# Altium project DelayedTimeRelay.PrjPcb
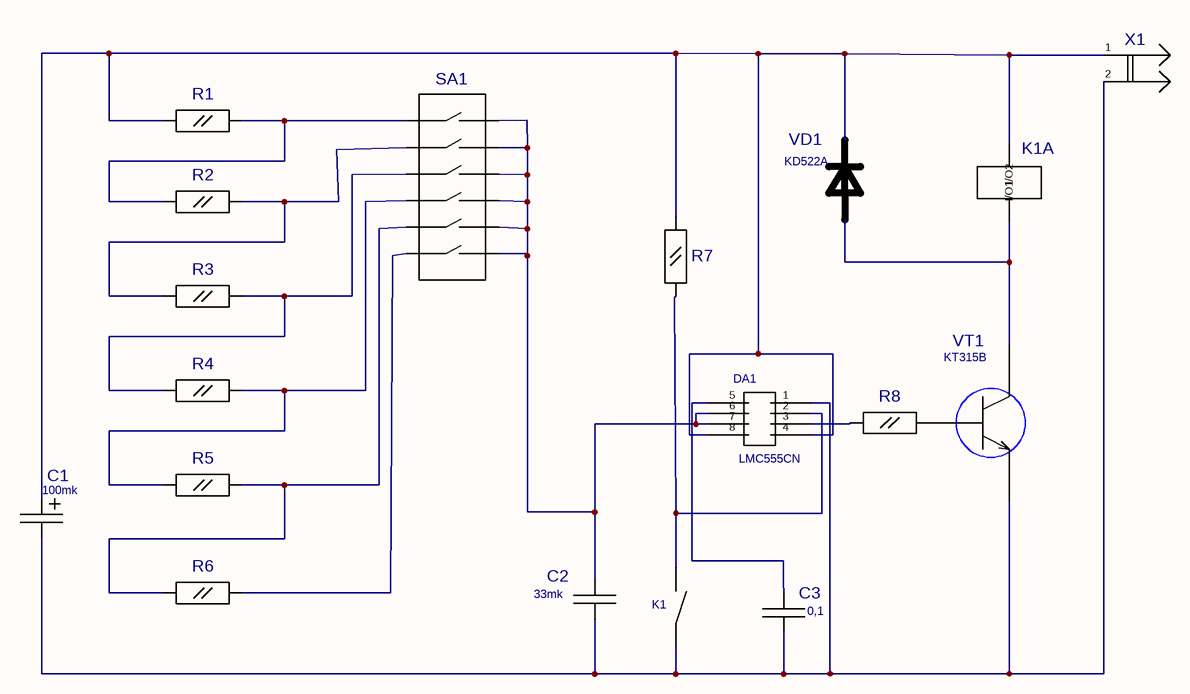
[diagram p0: Sheet1.SCHDOC]
1 sheet, 17 parts. Net scope: global (net labels, ports and power ports of the same name join across sheets).
Board file: DelayedTimeRelay.PcbDoc

## Sheet Sheet1.SCHDOC
size 297 x 209 mm; SheetNumber: 1; SheetTotal: 1; DocumentName: Sheet1.SCHDOC

### Parts
C1  value 100mk  [ECR-8]  (hidden comment: ECR-8)
C2  value 33mk  [1017-B3R]  (hidden comment: 1017-B3R)
C3  value 0,1  [1017-B3R]  (hidden comment: 1017-B3R)
DA1  LMC555CN  [LMC555CN]
K1  РЕЛЕ-6  [RELE6]  (value not drawn)  (parts A,B of 2)
R1  C2-33H-0.125W_OLD_UGO  [C2-33H-0.125W]  (value not drawn)
R2  C2-33H-0.125W_OLD_UGO  [C2-33H-0.125W]  (value not drawn)
R3  C2-33H-0.125W_OLD_UGO  [C2-33H-0.125W]  (value not drawn)
R4  C2-33H-0.125W_OLD_UGO  [C2-33H-0.125W]  (value not drawn)
R5  C2-33H-0.125W_OLD_UGO  [C2-33H-0.125W]  (value not drawn)
R6  C2-33H-0.125W_OLD_UGO  [C2-33H-0.125W]  (value not drawn)
R7  C2-33H-0.125W_OLD_UGO  [C2-33H-0.125W]  (value not drawn)
R8  C2-33H-0.125W_OLD_UGO  [C2-33H-0.125W]  (value not drawn)
SA1  DS1040-6  [DS1040-6]  (value not drawn)
VD1  value KD522A  [КД521(522)]  (hidden comment: КД522А)
VT1  value KT315B  [KT13]  (hidden comment: КТ315В)
X1  2XR  [2XR]  (value not drawn)

### Nets
NetC1_1: C1.1(I/OA) DA1.4 DA1.8 K1.2(I/O2) R1.1 R7.2 VD1.2(K) X1.1(I/O1)
NetC1_2: C1.2(I/OB) C2.2(I/OB) C3.2(I/OB) DA1.1 K1.3(I/O1) VT1.1(E) X1.2(I/O2)
NetC2_1: C2.1(I/OA) DA1.6 DA1.7 SA1.7 SA1.8 SA1.9 SA1.10 SA1.11 SA1.12
NetC3_1: C3.1(I/OA) DA1.5
NetDA1_2: DA1.2 K1.4(I/O2) R7.1
NetDA1_3: DA1.3 R8.1
NetK1_1: K1.1(I/O1) VD1.1(A) VT1.3(K)
NetR1_2: R1.2 R2.1 SA1.1
NetR2_2: R2.2 R3.1 SA1.2
NetR3_2: R3.2 R4.1 SA1.3
NetR4_2: R4.2 R5.1 SA1.4
NetR5_2: R5.2 R6.1 SA1.5
NetR6_2: R6.2 SA1.6
NetR8_2: R8.2 VT1.2(B)

### Library data of the parts
C2 C3 = 1017-B3R: PDIF_TY: 11201
K1 = РЕЛЕ-6: Value: K1
R1-R6 R8 = C2-33H-0.125W_OLD_UGO: Autor: pcbdesigner.ru; Value: *
R7 = C2-33H-0.125W_OLD_UGO_VARIANT_1: Autor: pcbdesigner.ru; Value: *
DA1 = LMC555CN: Value: *
SA1 = DS1040-6: Value: *; Author: pcbdesigner.ru
X1 = 2XR: Value: *